# Altium schematic sheet [5]EEPROM.SchDoc: EEPROM
size A4; Organization: Altium Limited; Address1: SPARC Lab; Address2: SEEE-HUST; Address3: Dai Co Viet, Ha Noi
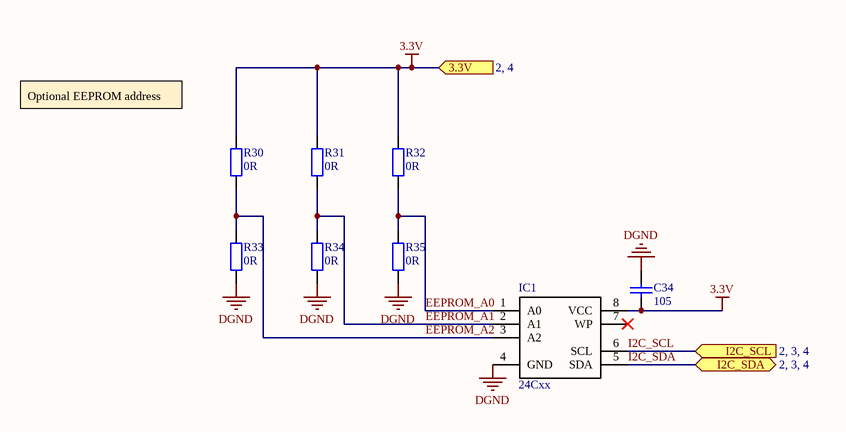
[diagram p0: [5]EEPROM.SchDoc]

## Parts
C34  105  [tu 0805]
IC1  24Cxx  [SO8]
R30  0R  [tro smd 0805]
R31  0R  [tro smd 0805]
R32  0R  [tro smd 0805]
R33  0R  [tro smd 0805]
R34  0R  [tro smd 0805]
R35  0R  [tro smd 0805]

## Ports
3.3V (in, see 2, 4), I2C_SCL (in, see 2, 3, 4), I2C_SDA (bidir, see 2, 3, 4)

## Nets
3.3V: C34.2 IC1.8(VCC) R30.2 R31.2 R32.2 ; port 3.3V
DGND: C34.1 IC1.4(GND) R33.1 R34.1 R35.1
EEPROM_A0: IC1.1(A0) R32.1 R35.2
EEPROM_A1: IC1.2(A1) R31.1 R34.2
EEPROM_A2: IC1.3(A2) R30.1 R33.2
I2C_SCL: IC1.6(SCL) ; port I2C_SCL
I2C_SDA: IC1.5(SDA) ; port I2C_SDA

Not connected (* = marked no-connect by the designer): IC1 7(WP)*

## Notes on the sheet
- Optional EEPROM address
- Title
- Size:
- Date:
- A4
- Number:
- Time:
- Revision:
- Sheet
- of
- File:

## Library data of the parts
C34 = Tu 0805 105 50V 10%: Dán; Don_Vi: Con; So_Chan: 2; Ten_Linh_Kien: Tụ 0805 105-1uF 10% 50V; Ma_Hang: MH004552; Chung_Loai: Dán; Kieu_Chan: *
IC1 = 24Cxx: Standard 2-Wire Bus Interface Serial EEPROM; Value: DIP 8; Value: 24Cxx; Copyright by: VanDungEvn
R30-R35 = Tro 0805 5% 0R: Dán; Don_Vi: Con; So_Chan: 2; Ten_Linh_Kien: Trở 0805 5% 0R; Ma_Hang: MH005230; Chung_Loai: Dán; Kieu_Chan: *